# EAGLE design motorboard_r2 (EAGLE 8.1.1)
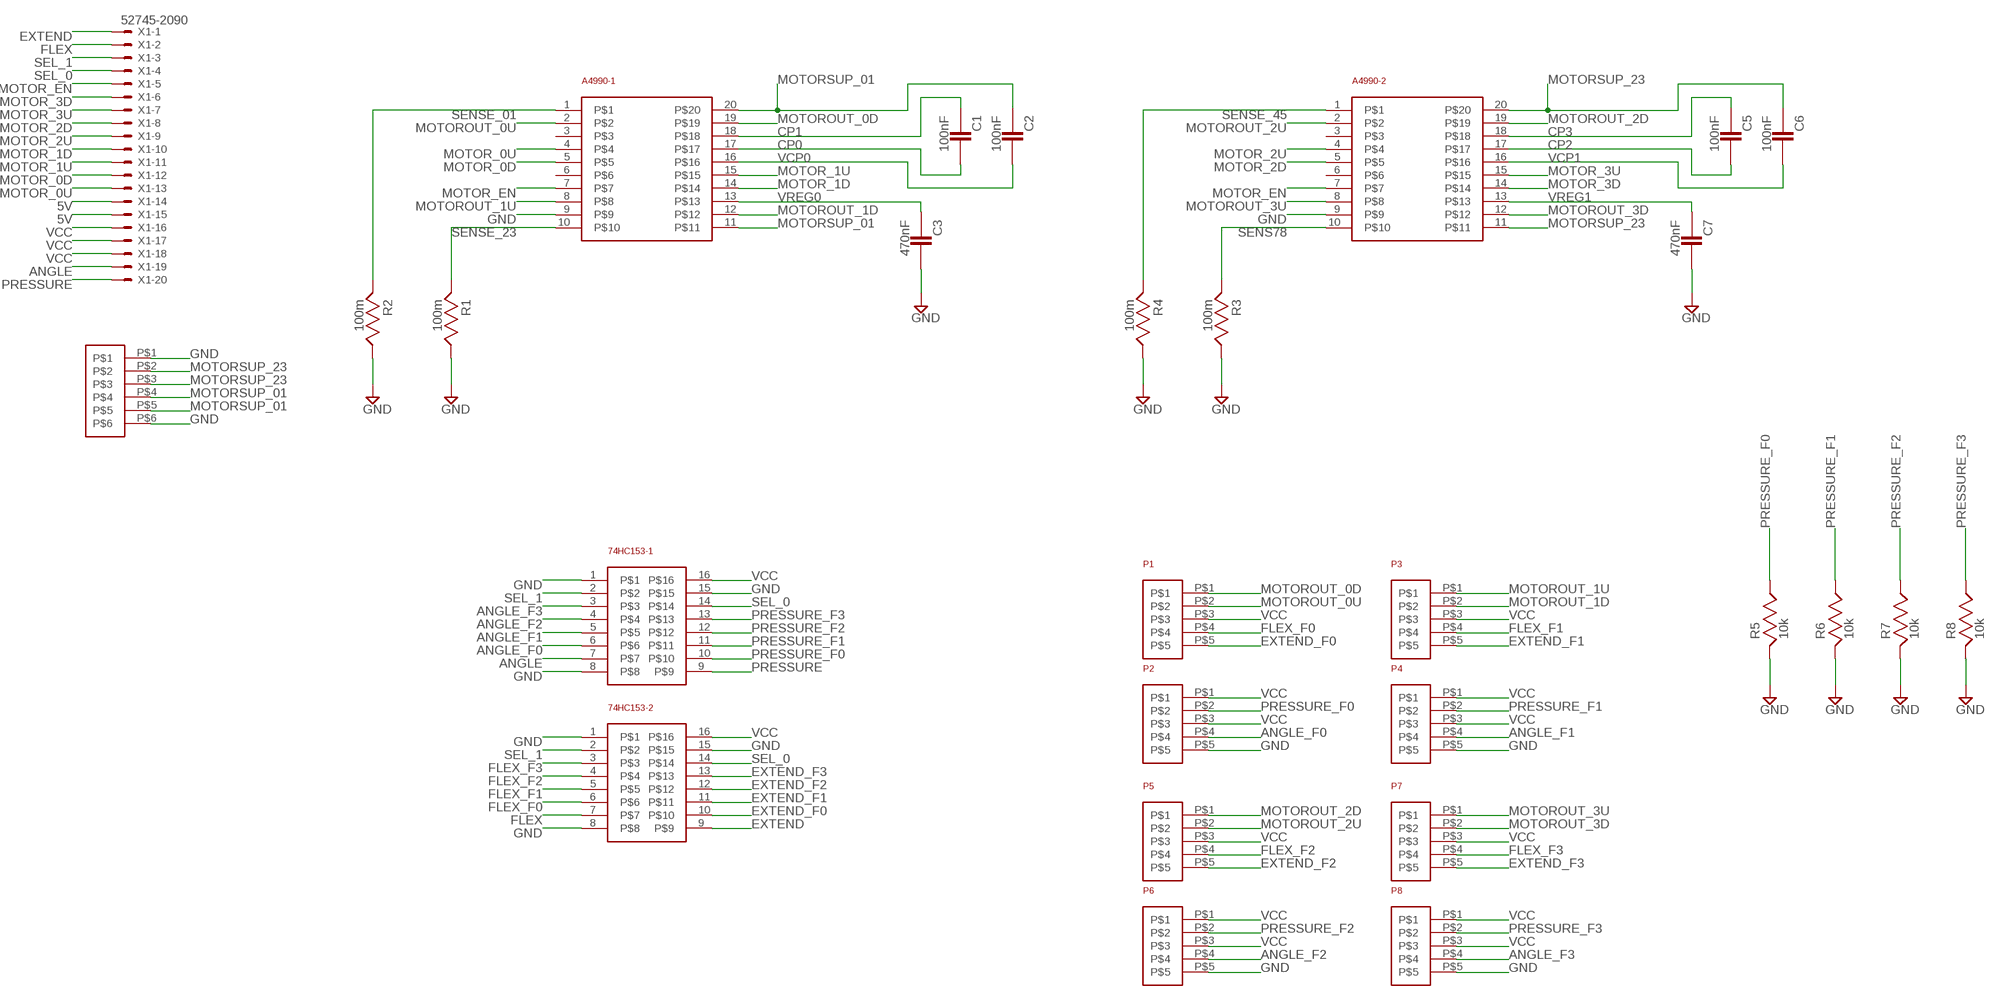
[diagram p0: schematic, sheet 1]

## Parts
74HC153-1  74HC153  [SO-16_S-M]
74HC153-2  74HC153  [SO-16_S-M]
A4990-1  A4990  [A4990]
A4990-2  A4990  [A4990]
C1  100nF  CC0603KRX7R9BB104  [CC0603KRX7R9BB104_CAPC1608X90]
C2  100nF  CC0603KRX7R9BB104  [CC0603KRX7R9BB104_CAPC1608X90]
C3  470nF  CC0603KRX7R9BB104  [CC0603KRX7R9BB104_CAPC1608X90]
C5  100nF  CC0603KRX7R9BB104  [CC0603KRX7R9BB104_CAPC1608X90]
C6  100nF  CC0603KRX7R9BB104  [CC0603KRX7R9BB104_CAPC1608X90]
C7  470nF  CC0603KRX7R9BB104  [CC0603KRX7R9BB104_CAPC1608X90]
P1  S5B-PH-SM4-TB  [S5B-PH-SM4-TB]
P2  S5B-PH-SM4-TB  [S5B-PH-SM4-TB]
P3  S5B-PH-SM4-TB  [S5B-PH-SM4-TB]
P4  S5B-PH-SM4-TB  [S5B-PH-SM4-TB]
P5  S5B-PH-SM4-TB  [S5B-PH-SM4-TB]
P6  S5B-PH-SM4-TB  [S5B-PH-SM4-TB]
P7  S5B-PH-SM4-TB  [S5B-PH-SM4-TB]
P8  S5B-PH-SM4-TB  [S5B-PH-SM4-TB]
R1  100m  CRCW06031K00FKEA  [CRCW06031K00FKEA_RESC1608X55]
R2  100m  CRCW06031K00FKEA  [CRCW06031K00FKEA_RESC1608X55]
R3  100m  CRCW06031K00FKEA  [CRCW06031K00FKEA_RESC1608X55]
R4  100m  CRCW06031K00FKEA  [CRCW06031K00FKEA_RESC1608X55]
R5  10k  CRCW06031K00FKEA  [CRCW06031K00FKEA_RESC1608X55]
R6  10k  CRCW06031K00FKEA  [CRCW06031K00FKEA_RESC1608X55]
R7  10k  CRCW06031K00FKEA  [CRCW06031K00FKEA_RESC1608X55]
R8  10k  CRCW06031K00FKEA  [CRCW06031K00FKEA_RESC1608X55]
U$1  PH-SM4-6  [PH-SM4-6]
X1  52745-2090  [52745-2090]

## Nets
5V: X1.14 X1.15
ANGLE: 74HC153-1.7 X1.19
ANGLE_F0: 74HC153-1.6 P2.P$4
ANGLE_F1: 74HC153-1.5 P4.P$4
ANGLE_F2: 74HC153-1.4 P6.P$4
ANGLE_F3: 74HC153-1.3 P8.P$4
CP0: A4990-1.17 C1.2
CP1: A4990-1.18 C1.1
CP2: A4990-2.17 C5.2
CP3: A4990-2.18 C5.1
EXTEND: 74HC153-2.9 X1.1
EXTEND_F0: 74HC153-2.10 P1.P$5
EXTEND_F1: 74HC153-2.11 P3.P$5
EXTEND_F2: 74HC153-2.12 P5.P$5
EXTEND_F3: 74HC153-2.13 P7.P$5
FLEX: 74HC153-2.7 X1.2
FLEX_F0: 74HC153-2.6 P1.P$4
FLEX_F1: 74HC153-2.5 P3.P$4
FLEX_F2: 74HC153-2.4 P5.P$4
FLEX_F3: 74HC153-2.3 P7.P$4
GND: 74HC153-1.1 74HC153-1.8 74HC153-1.15 74HC153-2.1 74HC153-2.8 74HC153-2.15 A4990-1.9 A4990-2.9 C3.2 C7.2 P2.P$5 P4.P$5 P6.P$5 P8.P$5 R1.2 R2.2 R3.2 R4.2 R5.1 R6.1 R7.1 R8.1 U$1.P$1 U$1.P$6
MOTOR_0D: A4990-1.5 X1.12
MOTOR_0U: A4990-1.4 X1.13
MOTOR_1D: A4990-1.14 X1.10
MOTOR_1U: A4990-1.15 X1.11
MOTOR_2D: A4990-2.5 X1.8
MOTOR_2U: A4990-2.4 X1.9
MOTOR_3D: A4990-2.14 X1.6
MOTOR_3U: A4990-2.15 X1.7
MOTOR_EN: A4990-1.7 A4990-2.7 X1.5
MOTOROUT_0D: A4990-1.19 P1.P$1
MOTOROUT_0U: A4990-1.2 P1.P$2
MOTOROUT_1D: A4990-1.12 P3.P$2
MOTOROUT_1U: A4990-1.8 P3.P$1
MOTOROUT_2D: A4990-2.19 P5.P$1
MOTOROUT_2U: A4990-2.2 P5.P$2
MOTOROUT_3D: A4990-2.12 P7.P$2
MOTOROUT_3U: A4990-2.8 P7.P$1
MOTORSUP_01: A4990-1.11 A4990-1.20 C2.1 U$1.P$4 U$1.P$5
MOTORSUP_23: A4990-2.11 A4990-2.20 C6.1 U$1.P$2 U$1.P$3
PRESSURE: 74HC153-1.9 X1.20
PRESSURE_F0: 74HC153-1.10 P2.P$2 R5.2
PRESSURE_F1: 74HC153-1.11 P4.P$2 R6.2
PRESSURE_F2: 74HC153-1.12 P6.P$2 R7.2
PRESSURE_F3: 74HC153-1.13 P8.P$2 R8.2
SEL_0: 74HC153-1.14 74HC153-2.14 X1.4
SEL_1: 74HC153-1.2 74HC153-2.2 X1.3
SENS78: A4990-2.10 R3.1
SENSE_01: A4990-1.1 R2.1
SENSE_23: A4990-1.10 R1.1
SENSE_45: A4990-2.1 R4.1
VCC: 74HC153-1.16 74HC153-2.16 P1.P$3 P2.P$1 P2.P$3 P3.P$3 P4.P$1 P4.P$3 P5.P$3 P6.P$1 P6.P$3 P7.P$3 P8.P$1 P8.P$3 X1.16 X1.17 X1.18
VCP0: A4990-1.16 C2.2
VCP1: A4990-2.16 C6.2
VREG0: A4990-1.13 C3.1
VREG1: A4990-2.13 C7.1
Unconnected: A4990-1.3 A4990-1.6 A4990-2.3 A4990-2.6

## Library data of the parts
74HC153-1 74HC153-2 = hands:74HC153
A4990-1 A4990-2 = hands:A4990
C1-C3 C5-C7 = Common-Parts-Library-Eagle:CC0603KRX7R9BB104: 0603 0.1 uF 50 V ±10 % Tolerance X7R SMT Multilayer Ceramic Capacitor; MANUFACTURER: YAGEO
P1-P8 = hands:S5B-PH-SM4-TB
R1-R8 = Common-Parts-Library-Eagle:CRCW06031K00FKEA: Res Thick Film 0603 1K Ohm 1% 0.1W(1/10W) ?100ppm/C SMD Automotive Paper T/R; MANUFACTURER: VISHAY
U$1 = hands:PH-SM4-6
X1 = con-molex:52745-2090: FFC/FPC-to-Board 0.50mm (.020") SMT Top Contact Right Angle, ZIF, Style Receptacle 52745 / 52435 Source: http://www.molex.com/product/ffc/52745.html; MF: WALDOM/MOLEX; MPN: 52745-2090; OC_FARNELL: unknown; OC_NEWARK: 38C9891

## Board
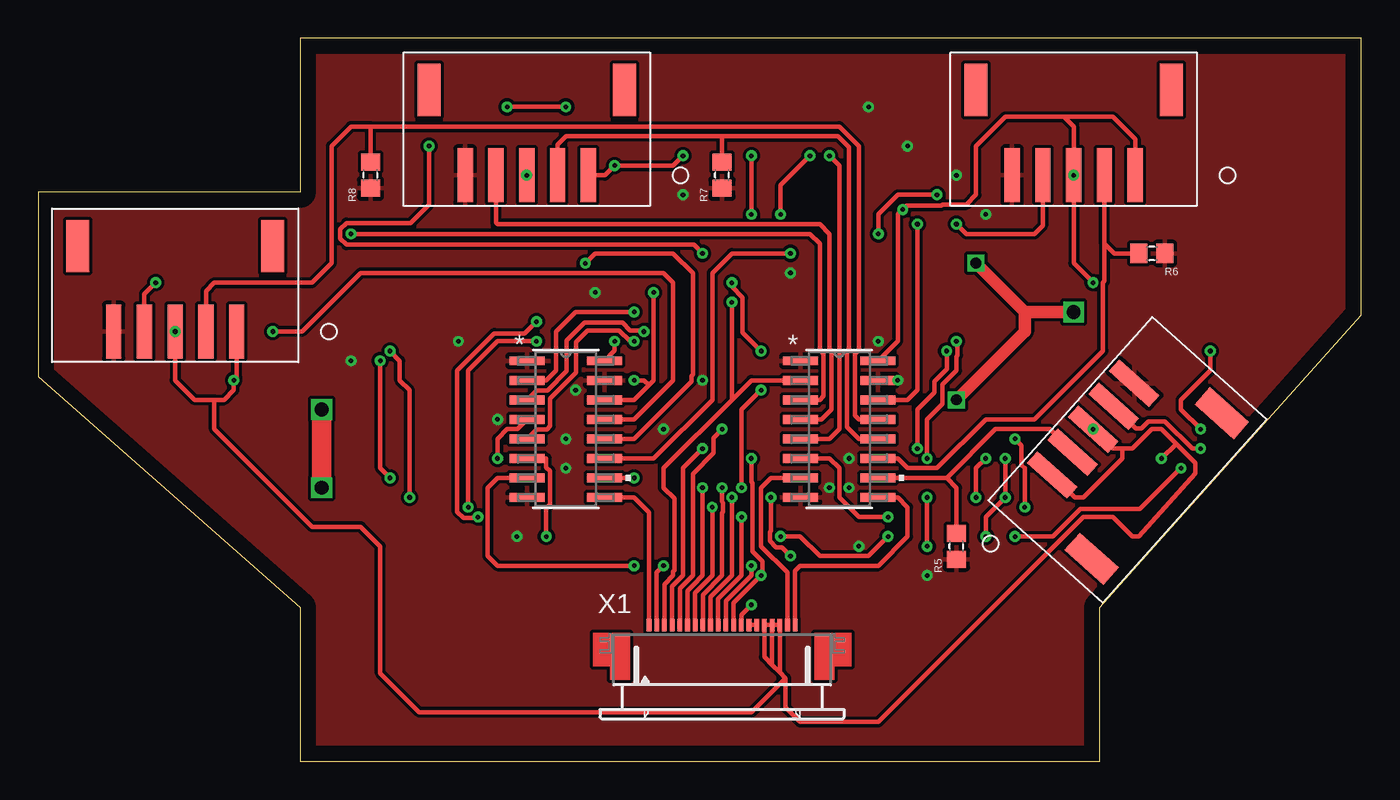
[diagram p1: board, top side]
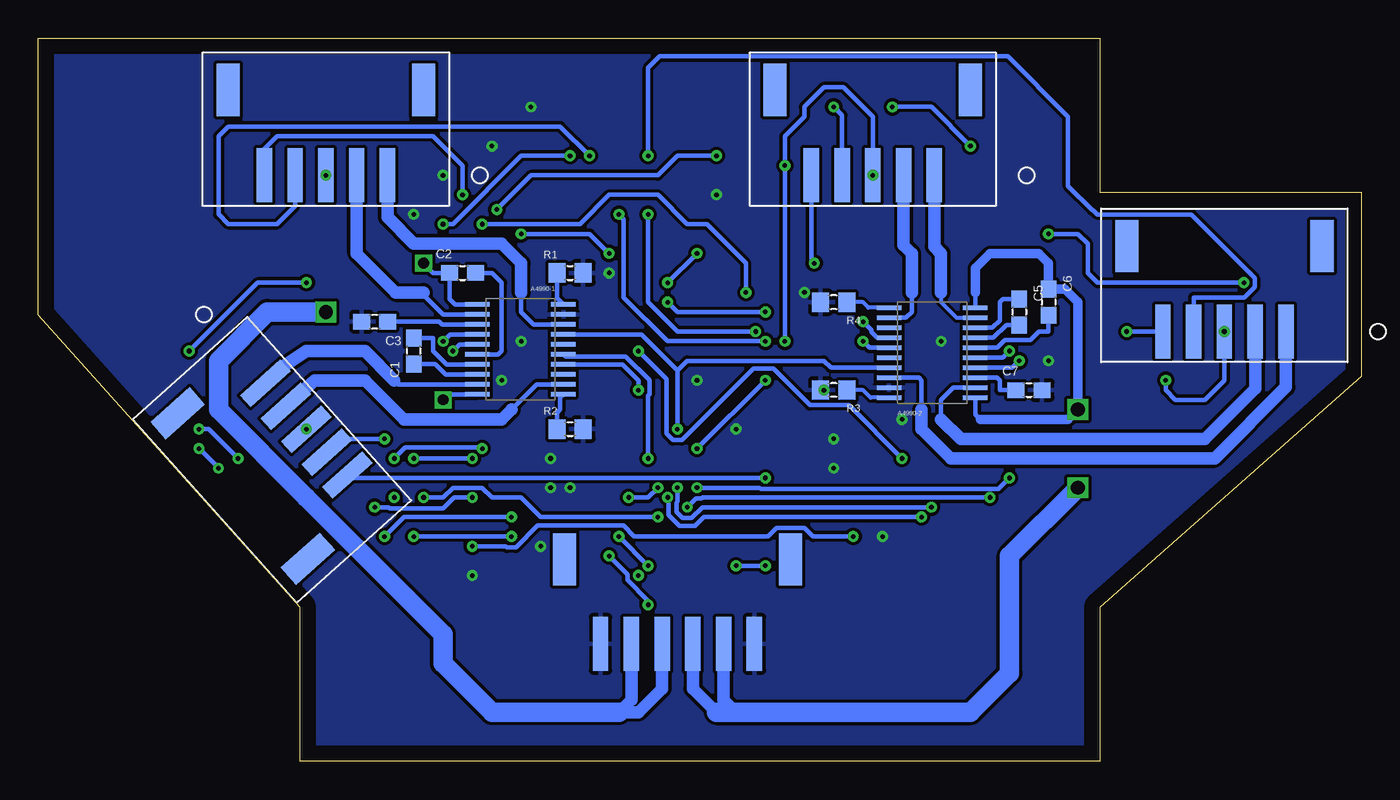
[diagram p2: board, bottom side, seen from below]

Size 86 x 47 mm. Coordinates in mm from the lower left corner, seen from the top.
Outline: 17,0 69,0 69,10 86,29 86,47 17,47 17,37 0,37 0,25 17,10 17,0
Copper layers (1*16): Top 0.035mm / dielectric 1.5mm / Bottom 0.035mm
Design rules "default": minimum track width 10mil, minimum drill 24mil, track to track 8mil, track to pad 8mil, pad to pad 8mil, via to via 8mil, smd to smd 8mil, copper to edge 40mil, drill to drill 8mil, minimum pad ring 10mil, minimum via ring 8mil, stop-mask expansion 4mil, vias tented up to drill 0mil, thermal gap 10mil

### Footprints (pad centres in the part's own frame; a part is rotated, then mirrored left to right if it is on the bottom)
SO-16_S-M = smd 2.286 x 0.584: 1 -2.515,4.445; 2 -2.515,3.175; 3 -2.515,1.905; 4 -2.515,0.635; 5 -2.515,-0.635; 6 -2.515,-1.905; 7 -2.515,-3.175; 8 -2.515,-4.445; 9 2.515,-4.445; 10 2.515,-3.175; 11 2.515,-1.905; 12 2.515,-0.635; 13 2.515,0.635; 14 2.515,1.905; 15 2.515,3.175; 16 2.515,4.445
A4990 = smd 1.6 x 0.3: 1 -2.748,2.822; 2 -2.748,2.172; 3 -2.748,1.522; 4 -2.748,0.872; 5 -2.748,0.222; 6 -2.748,-0.428; 7 -2.748,-1.078; 8 -2.748,-1.728; 9 -2.748,-2.378; 10 -2.748,-3.028; 11 2.853,-3.028; 12 2.853,-2.378; 13 2.853,-1.728; 14 2.853,-1.078; 15 2.853,-0.428; 16 2.853,0.222; 17 2.853,0.872; 18 2.853,1.522; 19 2.853,2.172; 20 2.853,2.822
CC0603KRX7R9BB104_CAPC1608X90 = smd 1.1 x 1: 1 -0.85,0; 2 0.85,0
S5B-PH-SM4-TB = smd 1 x 3.5: P$1 4,0; P$2 2,0; P$3 0,0; P$4 -2,0; P$5 -4,0 | smd 1.5 x 3.4: P$6 6.35,5.55; P$7 -6.35,5.55
CRCW06031K00FKEA_RESC1608X55 = smd 1.1 x 1.25: 1 -0.85,0; 2 0.85,0
PH-SM4-6 = smd 1 x 3.5: P$1 5,0; P$2 3,0; P$3 1,0; P$4 -1,0; P$5 -3,0; P$6 -5,0 | smd 1.5 x 3.4: P$7 7.35,5.5; P$8 -7.35,5.5
52745-2090 = smd 0.3 x 0.8: 1 -4.75,2.5; 2 -4.25,2.5; 3 -3.75,2.5; 4 -3.25,2.5; 5 -2.75,2.5; 6 -2.25,2.5; 7 -1.75,2.5; 8 -1.25,2.5; 9 -0.75,2.5; 10 -0.25,2.5; 11 0.25,2.5; 12 0.75,2.5; 13 1.25,2.5; 14 1.75,2.5; 15 2.25,2.5; 16 2.75,2.5; 17 3.25,2.5; 18 3.75,2.5; 19 4.25,2.5; 20 4.75,2.5

### Placement (x,y rotation side)
74HC153-1  52.07,21.59 0 top
74HC153-2  34.29,21.59 0 top
A4990-1  54.61,26.67 180 bottom
A4990-2  27.94,26.67 0 bottom
C1  61.59,26.67 90 bottom
C2  58.42,31.75 0 bottom
C3  64.14,28.57 180 bottom
C5  22.23,29.21 270 bottom
C6  20.32,29.84 270 bottom
C7  21.59,24.13 0 bottom
P1  68.58,21.59 131.8 bottom
P2  68.58,21.59 228.2 top
P3  67.31,38.1 0 bottom
P4  67.31,38.1 0 top
P5  31.75,38.1 0 bottom
P6  31.75,38.1 0 top
P7  8.89,27.94 0 bottom
P8  8.89,27.94 0 top
R1  51.44,31.75 0 bottom
R2  51.44,21.59 0 bottom
R3  34.29,24.13 180 bottom
R4  34.29,29.84 180 bottom
R5  59.69,13.97 90 top
R6  72.39,33.02 180 top
R7  44.45,38.1 90 top
R8  21.59,38.1 90 top
U$1  44.45,7.62 0 bottom
X1  44.45,6.35 0 top

### Tracks (layer width: path | path; a pad name or v marks a point on that pad's centre or on a via)
5V
  Top 0.305: X1.14 X1.15
ANGLE
  Top 0.305: X1.19 48.7,12.26 46.99,13.97 46.99,17.78 47.62,18.41 74HC153-1.7
ANGLE_F0  (via drill 0.3)
  Top 0.305: 74HC153-1.6 51.44,19.68 52.07,19.05 52.07,17.14 53.34,15.88 v55.24,15.88 | v74.3,19.05 71.63,16.38 67.73,16.38 65.96,14.61 v63.5,14.61 | v75.56,20.32 75.01,20.32 73.23,22.1 72.18,22.1 71.71,21.63 71.36,21.63 P2.P$4
  Bottom 0.305: v55.24,15.88 62.23,15.88 v63.5,14.61 | v74.3,19.05 v75.56,20.32
ANGLE_F1  (via drill 0.3)
  Top 0.305: v51.44,39.37 52.07,38.73 52.07,21.59 51.44,20.95 49.53,20.95 74HC153-1.5 | P4.P$4 65.31,34.83 64.77,34.29 60.33,34.29 v59.69,34.92
  Bottom 0.305: v59.69,34.92 59.05,34.92 54.61,39.37 v51.44,39.37
ANGLE_F2
  Top 0.305: P6.P$4 29.75,35.02 29.84,34.92 50.8,34.92 51.44,34.29 51.44,26.81 51.56,26.68 51.56,22.86 50.93,22.23 49.53,22.23 74HC153-1.4
ANGLE_F3  (via drill 0.3)
  Top 0.305: 74HC153-1.3 50.8,23.5 51.05,23.75 51.05,26.47 50.8,26.73 50.8,33.66 50.16,34.29 v20.32,34.29 | P8.P$4 6.89,30.39 v7.62,31.11
  Bottom 0.305: v20.32,34.29 18.41,34.29 17.78,33.66 17.78,31.75 17.14,31.11 v7.62,31.11
CP0
  Bottom 0.305: A4990-1.17 59.45,25.8 60.33,26.67 60.33,27.52 C1.2
CP1
  Bottom 0.305: A4990-1.18 59.52,25.15 60.19,25.82 C1.1
CP2
  Bottom 0.305: A4990-2.17 23.89,27.54 23.07,28.36 C5.2
CP3
  Bottom 0.305: A4990-2.18 23.96,28.19 23.5,28.66 23.5,29.84 23.28,30.06 C5.1
EXTEND
  Top 0.305: X1.1 39.7,16.18 38.73,17.14 74HC153-2.9
EXTEND_F0  (via drill 0.3)
  Top 0.305: 74HC153-2.10 v38.73,18.41
  Bottom 0.305: P1.P$5 65.72,18.41 v38.73,18.41
EXTEND_F1  (via drill 0.3)
  Top 0.305: 74HC153-2.11 40.01,19.68 43.81,23.5 43.81,31.75 45.09,33.02 v48.9,33.02 | v54.61,34.29 54.61,35.56 55.88,36.83 v58.42,36.83
  Bottom 0.305: v48.9,33.02 50.16,34.29 v54.61,34.29 | v58.42,36.83 58.42,38.73 60.33,40.64 70.48,40.64 71.31,39.81 P3.P$5
EXTEND_F2  (via drill 0.3)
  Top 0.305: 74HC153-2.12 38.73,20.95 41.59,23.81 | v35.56,32.38 36.2,33.02 41.27,33.02 42.55,31.75 42.55,25.4 | 41.59,23.81 42.47,24.69 | 42.55,25.4 42.55,25.13 | 42.55,25.4 42.55,25.13 | 42.55,25.13 42.47,25.06 42.47,24.69 | 42.47,24.69 41.59,23.81
  Bottom 0.305: v35.56,32.38 35.75,32.58 P5.P$5
EXTEND_F3  (via drill 0.3)
  Top 0.305: 74HC153-2.13 38.73,22.23 41.27,24.77 41.27,31.11 40.64,31.75 20.95,31.75 17.14,27.94 v15.24,27.94
  Bottom 0.305: v15.24,27.94 P7.P$5
FLEX  (via drill 0.3)
  Top 0.305: 74HC153-2.7 29.84,18.41 29.21,17.78 29.21,13.34 29.84,12.7 v38.73,12.7 | X1.2 40.2,12.26 v40.64,12.7
  Bottom 0.305: v38.73,12.7 v40.64,12.7
FLEX_F0  (via drill 0.3)
  Top 0.305: 74HC153-2.6 33.02,19.68 33.02,19.11 33.27,18.85 33.27,16.71 33.02,16.45 v33.02,14.61 | v57.78,13.97 v57.78,17.14 | v64.14,16.51 64.14,19.05 63.93,19.23 63.91,19.53 63.91,20.54 v63.5,20.95
  Bottom 0.305: v33.02,14.61 35.63,14.61 36.2,15.18 38,15.18 38.56,14.62 47.27,14.62 47.97,15.31 53.53,15.31 54.95,13.9 55.54,13.9 55.61,13.97 v57.78,13.97 | v57.78,17.14 58.97,17.14 59.68,16.44 63.16,16.44 63.23,16.51 v64.14,16.51 | v63.5,20.95 66.39,20.95 P1.P$4
FLEX_F1  (via drill 0.3)
  Top 0.305: v38.73,27.3 38.47,27.3 37.76,28.01 35.72,28.01 34.97,27.26 34.97,25.27 33.27,23.58 33.27,21.79 33.07,21.58 32.4,21.58 74HC153-2.5 | v48.26,35.56 48.26,37.47 v50.16,39.37
  Bottom 0.305: v38.73,27.3 45.09,27.3 47.94,30.16 47.94,35.24 v48.26,35.56 | v50.16,39.37 52.07,41.27 73.66,41.27 74.3,40.64 74.3,35.56 73.66,34.92 70.48,34.92 69.31,36.1 P3.P$4
FLEX_F2  (via drill 0.3)
  Top 0.305: 74HC153-2.4 31.15,21.6 30.48,21.6 29.84,20.96 v29.84,19.68 | v45.09,31.11 45.09,30.85 45.79,30.14 45.79,27.87 v46.99,26.67 | v43.18,33.02 42.62,33.58 20.03,33.58 19.61,34 19.61,34.58 20.03,35 24.2,35 25.4,36.2 v25.4,40.01 | v30.48,42.55 v34.29,42.55
  Bottom 0.305: v29.84,19.68 33.31,23.15 35.84,23.15 38.22,25.53 39.51,25.53 44.16,20.88 44.74,20.88 45.16,21.3 45.16,24.84 v46.99,26.67 | v45.09,31.11 v43.18,33.02 | v25.4,40.01 27.94,42.55 v30.48,42.55 | P5.P$4 33.75,42.01 v34.29,42.55
FLEX_F3  (via drill 0.3)
  Top 0.305: 74HC153-2.3 32.4,24.12 33.09,24.12 34.33,25.36 34.33,27.35 35.51,28.52 37.97,28.52 38.48,28.01 39.03,28.01 39.1,27.94 v39.37,27.94 | v46.35,35.56 v46.35,39.37
  Bottom 0.305: v39.37,27.94 44.45,27.94 46.35,29.84 v46.35,35.56 | v46.35,39.37 46.35,45.09 45.61,45.83 22.97,45.83 19.05,41.91 19.05,37.4 17.48,35.83 17.43,35.83 17.14,35.55 11.05,35.55 6.91,31.41 6.91,30.82 7.58,30.15 10.89,30.15 P7.P$4
GND  (via drill 0.3)
  other vias: 29.84,22.23 31.11,14.61 20.32,26.04 34.29,19.05 34.29,20.95 48.9,31.75 41.91,36.83 55.88,24.77 54.61,27.3 56.52,40.01 53.98,42.55 40.64,21.59 43.18,24.77 51.44,17.78 52.7,17.78 52.7,19.68 57.78,12.06 53.34,13.97 61.59,35.56 59.69,38.1 36.2,30.48 34.92,24.13 27.3,27.3
  pour Bottom: 95.25,61.59 95.25,-17.14 -17.78,-17.14 -17.78,61.59
  pour Top: 93.34,59.05 93.34,-15.24 -14.61,-15.24 -14.61,59.05
MOTOR_0D  (via drill 0.3)
  Top 0.305: X1.12 45.2,10.28 v46.99,12.06 46.99,12.33 47.06,12.41 47.06,12.99 46.43,13.63 46.43,18.07 46.35,18.15 v46.35,19.68
  Bottom 0.305: A4990-1.5 51.72,26.31 47.81,26.31 46.28,24.77 46.28,23.84 46.35,23.76 v46.35,19.68
MOTOR_0U  (via drill 0.3)
  Top 0.305: X1.13 45.7,9.51 v46.35,10.16 | v48.9,13.34 48.33,13.9 47.97,13.9 47.55,14.31 47.55,14.9 47.62,14.97 v47.62,17.14 | v45.72,17.78 45.72,22.86 v46.99,24.13
  Bottom 0.305: v48.9,13.34 47.7,12.14 47.7,11.77 46.35,10.43 v46.35,10.16 | v47.62,17.14 46.35,17.14 v45.72,17.78 | v46.99,24.13 46.99,24.77 48.02,25.8 A4990-1.4
MOTOR_1D  (via drill 0.3)
  Top 0.305: X1.10 44.2,10.54 45.72,12.06 v45.72,15.88 | v60.96,17.14 60.96,19.05 v61.59,19.68 | v57.78,19.68 57.78,22.23 58.78,23.22 58.78,24.49 59.69,25.4 59.69,26.3 59.76,26.38 59.76,26.96 59.69,27.04 v59.69,27.3
  Bottom 0.305: A4990-1.14 59.25,27.75 v59.69,27.3 | v45.72,15.88 53.34,15.88 54.61,17.14 56.52,17.14 57.15,17.78 59.05,17.78 59.69,17.14 v60.96,17.14 | v61.59,19.68 v57.78,19.68
MOTOR_1U  (via drill 0.3)
  Top 0.305: v59.05,26.67 59.05,25.48 58.27,24.7 58.27,23.98 57.15,22.86 v57.15,20.32 | v62.87,19.68 v62.87,17.14 61.59,15.88 v61.59,14.61 | X1.11 44.7,10.41 46.35,12.06 v46.35,12.7 | v48.26,14.61 49.53,14.61 50.8,13.34 53.98,13.34 v55.24,14.61
  Bottom 0.305: A4990-1.15 58.63,27.1 v59.05,26.67 | v57.15,20.32 57.42,20.32 57.49,20.39 62.16,20.39 v62.87,19.68 | v46.35,12.7 v48.26,14.61 | v55.24,14.61 v61.59,14.61
MOTOR_2D  (via drill 0.3)
  Top 0.305: X1.8 43.2,10.81 44.45,12.06 44.45,16.14 44.52,16.22 44.52,16.8 44.45,16.88 v44.45,17.78 | v27.94,16.51 27.94,25.4 29.84,27.3 v32.38,27.3
  Bottom 0.305: v27.94,16.51 42.81,16.51 43.52,15.8 44.11,15.8 44.52,16.22 44.52,16.8 44.45,16.88 v44.45,17.78 | v32.38,27.3 31.97,26.89 A4990-2.5
MOTOR_2U  (via drill 0.3)
  Top 0.305: X1.9 43.7,10.68 45.09,12.06 v45.09,17.14 | v32.38,28.57 31.62,27.81 29.64,27.81 27.23,25.41 27.23,16.22 27.65,15.8 28.23,15.8 28.31,15.88 v28.57,15.88
  Bottom 0.305: v45.09,17.14 45.03,17.09 45.03,16.01 44.32,15.29 43.31,15.29 42.73,15.88 v28.57,15.88 | v32.38,28.57 31.84,28.03 31.84,27.89 31.49,27.54 A4990-2.4
MOTOR_3D  (via drill 0.3)
  Top 0.305: X1.6 42.2,11.09 42.55,11.43 43.18,12.06 v43.18,17.78 | v22.86,18.41 22.23,19.05 v22.23,26.04
  Bottom 0.305: A4990-2.14 22.67,25.59 v22.23,26.04 | v43.18,17.78 39.1,17.78 39.03,17.71 23.57,17.71 v22.86,18.41
MOTOR_3U  (via drill 0.3)
  Top 0.305: X1.7 42.7,10.95 43.81,12.06 v43.81,16.51 | v24.13,17.14 24.13,24.13 23.5,24.77 23.5,26.04 v22.86,26.67
  Bottom 0.305: A4990-2.15 23.29,26.24 v22.86,26.67 | v43.81,16.51 43.25,17.07 42.89,17.07 42.81,17.14 v24.13,17.14
MOTOR_EN  (via drill 0.3)
  Top 0.305: X1.5 41.7,11.22 42.55,12.06 42.55,18.68 43.89,20.03 43.89,21.03 v44.45,21.59
  Bottom 0.305: v44.45,21.59 44.45,25.4 | A4990-1.7 46.8,27.75 44.45,25.4 | 44.45,25.4 43.81,26.04 34.92,26.04 34.48,25.59 A4990-2.7
MOTOROUT_0D
  Bottom 0.305: A4990-1.19 62.6,24.5 62.87,24.77 | P1.P$1 71.25,24.64 70.48,25.4
  Bottom 0.813: 70.48,25.4 68.58,26.67 64.77,26.67 62.87,24.77
MOTOROUT_0U
  Bottom 0.305: A4990-1.2 53.61,24.5 55.24,22.86
  Bottom 0.813: P1.P$2 68.03,24.77 64.77,24.77 62.23,22.23 55.88,22.23 55.24,22.86
MOTOROUT_1D
  Bottom 0.305: A4990-1.12 59.69,29.05 60.96,30.32 60.96,30.48
  Bottom 0.813: 60.96,30.48 62.77,30.48 65.31,33.02 P3.P$2
MOTOROUT_1U
  Bottom 0.305: A4990-1.8 53.8,28.4 54.61,29.21 54.61,30.48
  Bottom 0.813: 54.61,30.48 54.61,32.38 55.88,33.66 61.59,33.66 63.31,35.37 P3.P$1
MOTOROUT_2D
  Bottom 0.254: 27.3,30.48 27.3,29.84 26.3,28.84 A4990-2.19
  Bottom 0.813: P5.P$1 27.75,33.47 27.3,33.02 27.3,30.48
MOTOROUT_2U
  Bottom 0.305: A4990-2.2 29.58,28.84 29.21,29.21 29.21,30.48
  Bottom 0.813: P5.P$2 29.75,33.56 29.21,33.02 29.21,30.48
MOTOROUT_3D
  Bottom 0.305: 27.3,22.23 27.3,23.5 26.51,24.29 A4990-2.12
  Bottom 0.813: P7.P$2 6.89,24.23 10.16,20.95 26.04,20.95 27.3,22.23
MOTOROUT_3U
  Bottom 0.305: A4990-2.8 28.75,24.94 28.57,24.77 28.57,22.86
  Bottom 0.813: 28.57,22.86 28.57,21.59 26.67,19.68 9.53,19.68 4.89,24.32 P7.P$1
MOTORSUP_01  (via drill 0.7, 0.9)
  Top 0.813: v67.31,29.21 64.14,29.21 | 64.14,29.21 v60.96,32.38 | 64.14,29.21 64.14,27.94 v59.69,23.5
  Bottom 0.305: A4990-1.11 58.91,29.7 59.27,30.06 C2.1 60.33,31.75 v60.96,32.38 | v59.69,23.5 59.34,23.85 A4990-1.20
  Bottom 0.813: U$1.P$4 45.45,4.71 46.99,3.17 48.26,3.17 47.45,3.98 U$1.P$5
  Bottom 1.27: 48.26,3.17 56.52,3.17 59.69,6.35 59.69,8.26 68.58,17.14 74.3,22.86 74.3,26.04 71.12,29.21 v67.31,29.21
MOTORSUP_23  (via drill 0.9)
  Top 1.27: v18.41,17.78 v18.41,22.86
  Bottom 0.305: A4990-2.20 25.09,30.48 | A4990-2.11 25.09,22.55 24.77,22.23 | 41.45,3.98 41.45,3.63 41.91,3.17
  Bottom 0.61: 25.09,30.48 25.09,32.06 24.13,33.02 20.95,33.02 20.32,32.38 C6.1 19.27,30.7 18.41,29.84 v18.41,22.86 19.05,22.23 24.77,22.23
  Bottom 0.813: U$1.P$2 41.45,3.98 40.64,3.17 | U$1.P$3 43.45,4.71 41.91,3.17
  Bottom 1.27: 41.91,3.17 25.4,3.17 22.86,5.71 22.86,13.34 v18.41,17.78
PRESSURE
  Top 0.305: X1.20 49.2,12.37 49.53,12.7 54.61,12.7 56.52,14.61 56.52,16.51 55.88,17.14 74HC153-1.9
PRESSURE_F0
  Top 0.305: 59.05,18.41 74HC153-1.10 | P2.P$2 65.76,21.59 62.23,21.59 59.05,18.41 | R5.2 59.69,17.78 59.05,18.41
PRESSURE_F1
  Top 0.305: 74HC153-1.11 55.88,19.68 56.52,19.05 58.42,19.05 61.59,22.23 64.77,22.23 69.22,26.67 69.22,31.11 69.31,31.21 69.31,33.66 | 69.31,33.66 P4.P$2 | R6.2 69.94,33.02 69.31,33.66
PRESSURE_F2
  Top 0.305: 44.45,40.64 34.29,40.64 33.75,40.1 P6.P$2 | 44.45,40.64 51.99,40.64 52.7,39.92 52.7,26.81 52.58,26.68 52.58,21.72 53.34,20.95 74HC153-1.12 | R7.2 44.45,40.64
PRESSURE_F3
  Top 0.305: P8.P$2 10.89,30.57 11.43,31.11 17.78,31.11 19.05,32.38 19.05,40.01 20.32,41.27 21.59,41.27 | 21.59,41.27 52.07,41.27 53.34,40.01 53.34,26.73 53.09,26.47 53.09,22.48 53.34,22.23 74HC153-1.13 | R8.2 21.59,41.27
SEL_0  (via drill 0.3)
  Top 0.305: v57.15,34.92 57.15,24.13 56.52,23.5 74HC153-1.14 | v40.01,30.48 40.01,24.77 39.69,24.45 | 39.69,24.45 38.73,23.5 74HC153-2.14 | X1.4 41.2,11.36 41.91,12.06 41.91,19.05 v43.18,20.32 | v38.73,24.77 39.37,24.77 39.69,24.45
  Bottom 0.305: v57.15,34.92 50.8,34.92 48.9,36.83 45.72,36.83 43.81,34.92 42.55,34.92 40.01,32.38 v40.01,30.48 | v43.18,20.32 v38.73,24.77
SEL_1  (via drill 0.3)
  Top 0.305: X1.3 40.7,11.49 41.27,12.06 41.27,12.33 41.35,12.41 41.35,17.07 40.64,17.78 40.64,19.05 45.09,23.5 | 45.09,23.5 46.35,24.77 74HC153-1.2 | 45.09,23.5 v45.09,29.84 | v38.73,29.21 34.92,29.21 33.66,27.94 33.66,25.4 33.02,24.77 74HC153-2.2
  Bottom 0.305: v45.09,29.84 44.45,29.21 v38.73,29.21
SENS78
  Bottom 0.254: A4990-2.10 31.9,23.64 32.38,24.13 R3.1
SENSE_01
  Bottom 0.305: A4990-1.1 52.07,23.64 52.07,22.86 52.28,22.64 R2.1
SENSE_23
  Bottom 0.305: A4990-1.10 52.28,30.12 R1.1
SENSE_45
  Bottom 0.254: A4990-2.1 32.03,29.49 32.38,29.84 R4.1
VCC  (via drill 0.3)
  Top 0.305: 47.62,8.89 47.59,8.85 X1.16 47.2,6.78 47.7,6.28 | X1.18 X1.17 47.7,6.28 | X1.18 48.2,5.78 | 48.2,5.78 48.58,5.4 | 47.7,6.28 48.2,5.78 | 48.58,5.4 48.58,3.49 49.53,2.54 54.61,2.54 67.94,15.88 69.85,15.88 71.12,14.61 71.55,14.61 75.23,18.71 75.23,19.39 73.98,20.64 | 70.48,20.32 71.12,20.32 72.39,21.59 73.03,21.59 73.98,20.64 | 70.48,20.32 69.85,20.32 P2.P$3 | P2.P$1 67.38,17.14 67.94,17.14 70.48,19.68 70.48,20.32 | 74HC153-1.16 55.88,27.33 55.88,35.56 v56.2,35.88 56.44,36.12 58.71,36.12 58.79,36.2 60.33,36.2 60.96,36.83 60.96,40.01 62.87,41.91 66.67,41.91 | 66.67,41.91 67.31,41.27 P4.P$3 67.31,32.38 v68.58,31.11 | 66.67,41.91 69.85,41.91 71.31,40.45 P4.P$1 | P6.P$1 36.83,38.1 v37.47,38.73 41.27,38.73 v41.91,39.37 | 74HC153-2.16 37.47,26.7 v37.47,27.3 | P8.P$3 8.89,24.77 10.16,23.5 11.43,23.5 | 11.43,23.5 12.06,23.5 12.7,24.13 v12.7,24.77 12.89,24.95 P8.P$1 | 48.58,5.4 46.35,3.17 24.77,3.17 22.23,5.71 22.23,13.97 20.95,15.24 17.78,15.24 11.43,21.59 11.43,23.5 | v76.2,26.67 76.2,25.4 74.3,23.5 74.3,22.86 v75.56,21.59 | v73.03,19.68 73.98,20.64
  Bottom 0.305: P2.P$3 67.94,22.23 | P6.P$3 31.75,41.91 33.66,43.81 34.92,43.81 36.2,42.55 36.2,41.91 37.47,40.64 v37.47,38.73 v37.47,27.3 | P8.P$3 8.89,24.77 10.16,23.5 12.06,23.5 12.7,24.13 v12.7,24.77 | v41.91,39.37 44.45,39.37 45.72,38.1 53.98,38.1 v56.2,35.88 | v68.58,31.11 71.75,31.11 v76.2,26.67 | v75.56,21.59 74.93,21.59 v73.03,19.68
  other vias: 68.58,21.59 67.31,38.1 31.75,38.1 8.89,27.94
VCP0
  Bottom 0.305: A4990-1.16 56.1,26.45 55.88,26.67 55.88,31.11 56.52,31.75 C2.2
VCP1
  Bottom 0.305: A4990-2.16 23.64,26.89 23.15,27.38 21.52,27.38 20.95,27.94 20.32,27.94 C6.2
VREG0
  Bottom 0.305: A4990-1.13 59.76,28.4 59.94,28.57 C3.1
VREG1
  Bottom 0.305: A4990-2.13 23.67,24.94 23.5,24.77 23.5,24.13 C7.1